# Altium project CYAN_EVSE_Power_board_v1.1.PrjPcb
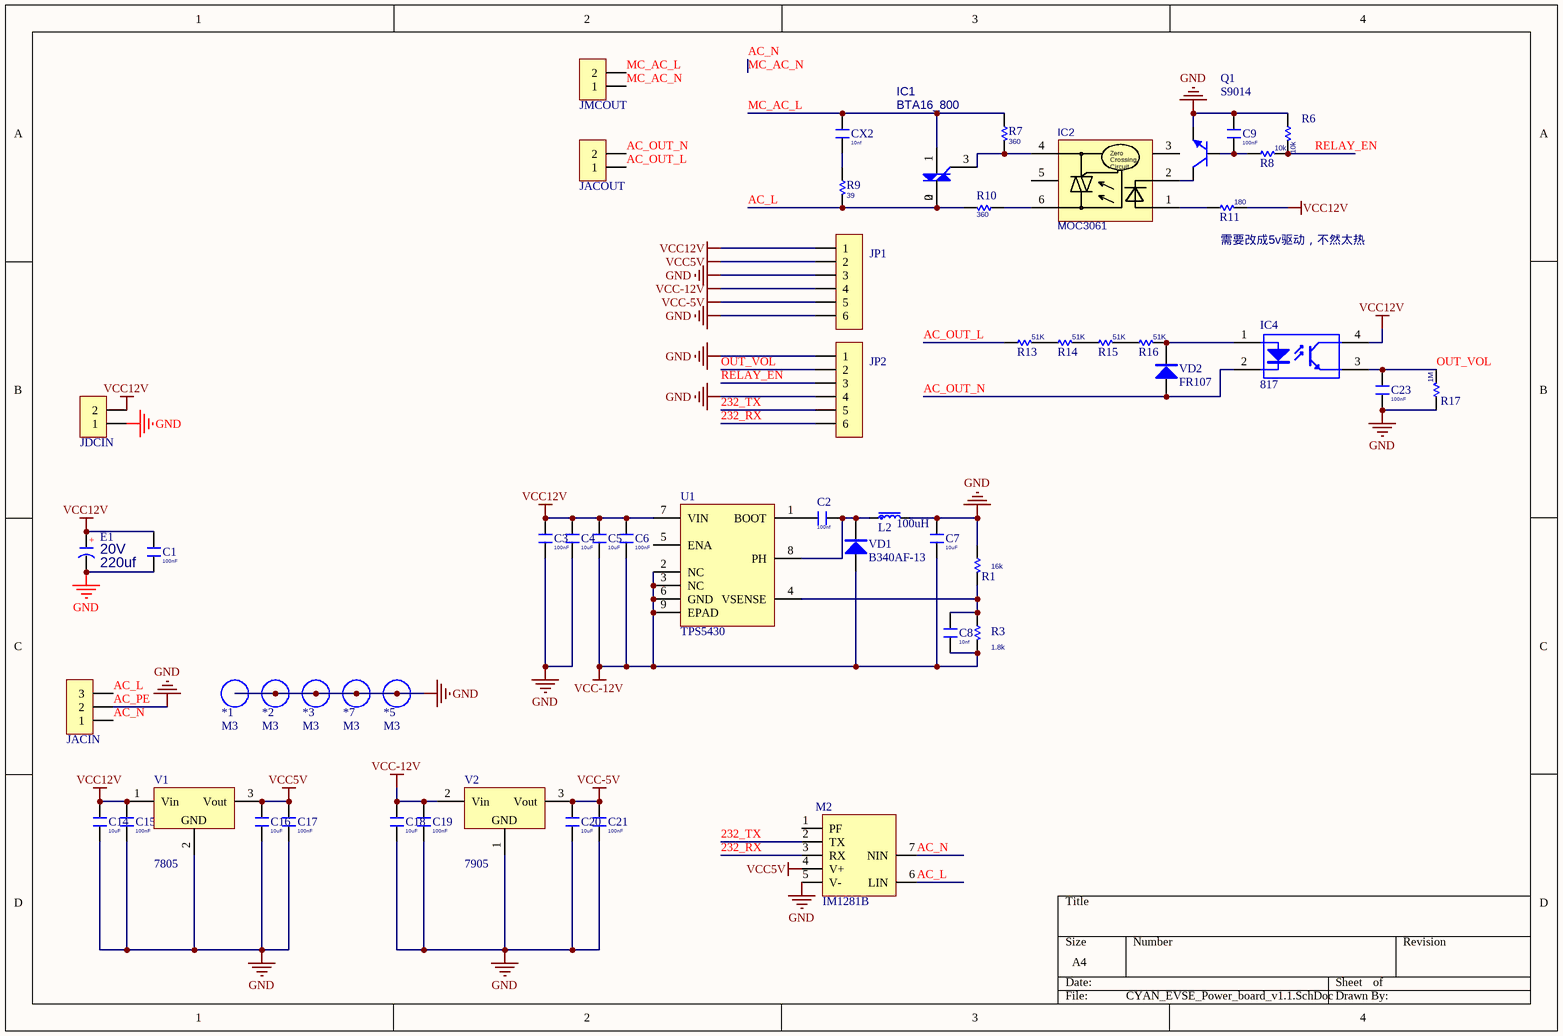
[diagram p0: CYAN_EVSE_Power_board_v1.1.SchDoc]
1 sheet, 55 parts. Net scope: global (net labels, ports and power ports of the same name join across sheets).
Board file: CYAN_EVSE_Power_board_v1.1.PcbDoc

## Sheet CYAN_EVSE_Power_board_v1.1.SchDoc
size A4

### Parts
*1  M3  [M3 125X300]
*2  M3  [M3 125X300]
*3  M3  [M3 125X300]
*5  M3  [M3 125X300]
*7  M3  [M3 125X300]
C1  value 100nF  [C 0805]  (hidden comment: C)
C2  value 100nf  [C 0805]  (hidden comment: C)
C3  value 100nF  [C 0805]  (hidden comment: C)
C4  value 10uF  [C 0805]  (hidden comment: C)
C5  value 10uF  [C 0805]  (hidden comment: C)
C6  value 100nF  [C 0805]  (hidden comment: C)
C7  value 10uF  [C 0805]  (hidden comment: C)
C8  value 10nf  [C 0805]  (hidden comment: C)
C9  value 100nF  [C 0805]  (hidden comment: C)
C14  value 10uF  [C 0805]  (hidden comment: C)
C15  value 100nF  [C 0805]  (hidden comment: C)
C16  value 10uF  [C 0805]  (hidden comment: C)
C17  value 100nF  [C 0805]  (hidden comment: C)
C18  value 10uF  [C 0805]  (hidden comment: C)
C19  value 100nF  [C 0805]  (hidden comment: C)
C20  value 10uF  [C 0805]  (hidden comment: C)
C21  value 100nF  [C 0805]  (hidden comment: C)
C23  value 100nF  [C 0805]  (hidden comment: C)
CX2  value 10nf  [CX 10*13*11]  (hidden comment: X1 安规电容)
E1  value 220uf  Voltage: 20V  [CM D(6.3*5.4)]  (hidden comment: C-CM)
IC1  BTA16_800  [TO220B]
IC2  MOC3061  [DIP6-300]
IC4  817  [SOP4-W2.54_M]
JACIN  HDR-1X3  [KF2EDGK5.0-3P_H]  (value not drawn)
JACOUT  HDR-1X2  [MC 1,5/ 2-G-3,81]  (value not drawn)
JDCIN  HDR-1X2  [MC 1,5/ 2-G-3,81]  (value not drawn)
JMCOUT  HDR-1X2  [MC 1,5/ 2-G-3,81]  (value not drawn)
JP1  HDR-1X6  [XH2.54-6P]  (value not drawn)
JP2  HDR-1X6  [XH2.54-6P]  (value not drawn)
L2  100uH  [CD75]
M2  IM1281B  [IM1281B]
Q1  S9014  [SOT23-3N]
R1  value 16k  [R 0805]  (hidden comment: R)
R3  value 1.8k  [R 0805]  (hidden comment: R)
R6  value 10k  [R 0805]  (hidden comment: R)
R7  value 360  [RS 1/2W]  (hidden comment: R-CRR)
R8  value 10k  [R 0805]  (hidden comment: R)
R9  value 39  [RS 2W]  (hidden comment: R-CRR)
R10  value 360  [RS 1/2W]  (hidden comment: R-CRR)
R11  value 180  [R 0805]  (hidden comment: R)
R13  value 51K  [R 1206]  (hidden comment: R)
R14  value 51K  [R 1206]  (hidden comment: R)
R15  value 51K  [R 1206]  (hidden comment: R)
R16  value 51K  [R 1206]  (hidden comment: R)
R17  value 1M  [R 0805]  (hidden comment: R)
U1  TPS5430  [SOP8_EPAD_VIA]
V1  7805  [TO252]
V2  7905  [TO252]
VD1  B340AF-13  [SMA]
VD2  FR107  [SOD-123]

### Nets
AC_PE: *1.0 *2.0 *3.0 *5.0 *7.0 C1.1 C3.1 C4.2 C7.2 C9.1 C14.1 C15.1 C16.1 C17.1 C18.1 C19.1 C20.1 C21.1 C23.1 E1.2 JACIN.2 JDCIN.1 JP1.3 JP1.6 JP2.1 JP2.4 L2.2 M2.5(V-) Q1.2(E) R1.1 R6.1 R17.1 V1.2(GND) V2.1(GND)  [also labelled GND]
VCC5V: C16.2 C17.2 JP1.2 M2.4(V+) V1.3(Vout)
VCC12V: C1.2 C3.2 C4.1 C5.2 C6.2 C14.2 C15.2 E1.1 IC4.4(C) JDCIN.2 JP1.1 R11.2 U1.7(VIN) V1.1(Vin)
VCC-5V: C20.2 C21.2 JP1.5 V2.3(Vout)
VCC-12V: C5.1 C6.1 C7.1 C8.2 C18.2 C19.2 JP1.4 R3.2 U1.2(NC) U1.3(NC) U1.6(GND) U1.9(EPAD) V2.2(Vin) VD1.1(A)
232_RX: JP2.6 M2.3(RX)
232_TX: JP2.5 M2.2(TX)
AC_L: IC1.0 IC1.2(A2) JACIN.3 M2.6(LIN) R9.2 R10.2
AC_N: JACIN.1 JMCOUT.1 M2.7(NIN)  [also labelled MC_AC_N]
AC_OUT_L: JACOUT.1 R13.1
AC_OUT_N: IC4.2(K) JACOUT.2 VD2.1(A)
MC_AC_L: CX2.1 IC1.1(A1) JMCOUT.2 R7.1
OUT_VOL: C23.2 IC4.3(E) JP2.2 R17.2
RELAY_EN: JP2.3 R6.2 R8.2
NetC2_1: C2.1 U1.1(BOOT)
NetC2_2: C2.2 L2.1 U1.8(PH) VD1.2(K)
NetC8_1: C8.1 R1.2 R3.1 U1.4(VSENSE)
NetC9_2: C9.2 Q1.1(B) R8.1
NetCX2_2: CX2.2 R9.1
NetIC1_3: IC1.3(G) IC2.4(T2) R7.2
NetIC2_1: IC2.1(A) R11.1
NetIC2_2: IC2.2(K) Q1.3(C)
NetIC2_6: IC2.6(T1) R10.1
NetIC4_1: IC4.1(A) R16.2 VD2.2(K)
NetR13_2: R13.2 R14.1
NetR14_2: R14.2 R15.1
NetR15_2: R15.2 R16.1

Not connected (* = marked no-connect by the designer): IC2 3(NC) 5(NC); M2 1(PF); U1 5(ENA)

### Notes on the sheet
- (near R11) 需要改成5v驱动，不然太热
- (in symbol C-CM) +
- (in symbol MOC304(6)1) Zero / Crossing / Circuit

### Library data of the parts
*1-*3 *5 *7 = M3: 铜柱孔
C1 C7 = C: 无极性贴片电容; Voltage: 25V
C2-C6 C8 C14-C21 = C: 无极性贴片电容; Voltage: 50V
C9 C23 = C: 无极性贴片电容; Voltage: 20V
CX2 = C-CX: X电容; Voltage: 440V
E1 = C-CM: 贴片电解电容
IC1 = BTA12_600: 双向可控硅
IC2 = MOC304(6)1: 4(6)00v 带过0检测 光电可控硅 led电流15ma 1.3v; BOM_Manufacturer: FAIRCHILD; BOM_Manufacturer Part: MOC3041M; BOM_Supplier: LCSC; image: //image.lceda.cn/szlcsc/C8921.jpg; BOM_Supplier Part: C8921; spicePre: U; spiceSymbolName: MOC3041M
IC4 = 817: 线性光耦
JACIN = Header 3: 3P接插件
JACOUT JDCIN JMCOUT = Header 2: 2P接插件
JP1 JP2 = Header 6: 6P接插件
L2 = L-CD: 贴片功率电感
M2 = IM1281B: 单相交流电能计量模块
Q1 = 9014-SMD: 低噪放大-NPN型
R1 R3 R6 R8 R11 R13-R17 = R: 贴片电阻
R7 R9 R10 = R-CRR: 直插色环电阻
U1 = TPS5430: 3A 36v buck控制器，内置fet
V1 = 78xx: 线性稳压芯片
V2 = 79xx: 线性稳压芯片
VD1 = SS14: 肖特基二极管
VD2 = FR107: 快恢复整流二极管